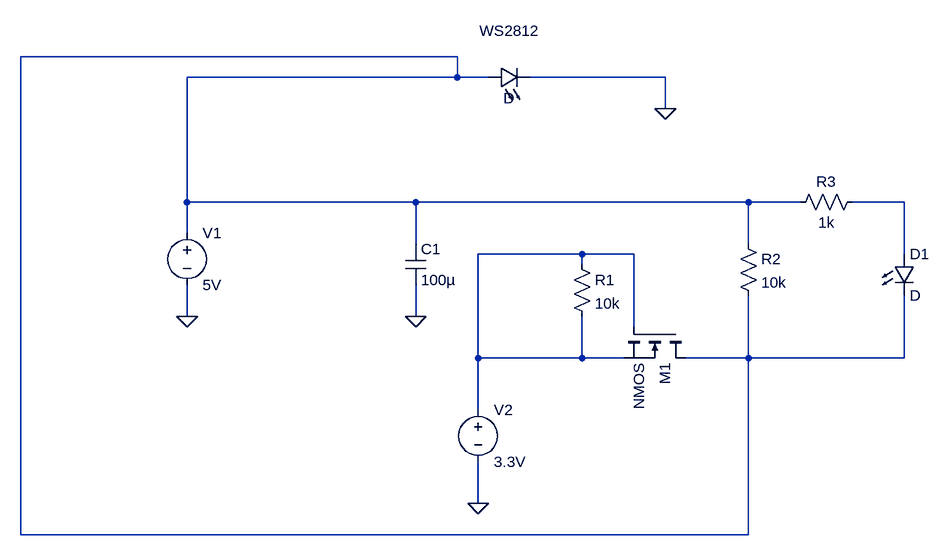
[diagram p0: schematic SmartLight - Schematic1.asc]
SmartLight - Schematic1.asc, the LTspice schematic file:
Version 4
SHEET 1 1212 680
WIRE 464 -128 -208 -128
WIRE 464 -96 464 -128
WIRE 464 -96 48 -96
WIRE 512 -96 464 -96
WIRE 784 -96 576 -96
WIRE 784 -48 784 -96
WIRE 48 96 48 -96
WIRE 400 96 48 96
WIRE 912 96 400 96
WIRE 992 96 912 96
WIRE 1152 96 1072 96
WIRE 48 144 48 96
WIRE 400 160 400 96
WIRE 912 160 912 96
WIRE 656 176 496 176
WIRE 736 176 656 176
WIRE 1152 176 1152 96
WIRE 656 192 656 176
WIRE 48 272 48 224
WIRE 400 272 400 224
WIRE 736 288 736 176
WIRE 496 336 496 176
WIRE 656 336 656 272
WIRE 656 336 496 336
WIRE 720 336 656 336
WIRE 912 336 912 240
WIRE 912 336 816 336
WIRE 1152 336 1152 240
WIRE 1152 336 912 336
WIRE 496 416 496 336
WIRE 496 560 496 496
WIRE -208 608 -208 -128
WIRE 912 608 912 336
WIRE 912 608 -208 608
FLAG 48 272 0
FLAG 496 560 0
FLAG 400 272 0
FLAG 784 -48 0
SYMBOL voltage 48 128 R0
WINDOW 123 0 0 Left 0
WINDOW 39 0 0 Left 0
SYMATTR InstName V1
SYMATTR Value 5V
SYMBOL voltage 496 400 R0
WINDOW 123 0 0 Left 0
WINDOW 39 0 0 Left 0
SYMATTR InstName V2
SYMATTR Value 3.3V
SYMBOL res 640 176 R0
SYMATTR InstName R1
SYMATTR Value 10k
SYMBOL res 896 144 R0
SYMATTR InstName R2
SYMATTR Value 10k
SYMBOL cap 384 160 R0
SYMATTR InstName C1
SYMATTR Value 100µ
SYMBOL nmos 816 288 R90
SYMATTR InstName M1
SYMBOL LED 1136 176 R0
SYMATTR InstName D1
SYMBOL res 1088 80 R90
WINDOW 0 0 56 VBottom 2
WINDOW 3 32 56 VTop 2
SYMATTR InstName R3
SYMATTR Value 1k
SYMBOL LED 512 -80 R270
WINDOW 0 72 32 VTop 2
WINDOW 3 0 32 VBottom 2
SYMATTR InstName WS2812

The netlist it stands for:
* SmartLight - Schematic1.asc
V1 N001 0 5V
V2 N003 0 3.3V
R1 N003 N003 10k
R2 N001 N001 10k
C1 N001 0 100µ
M1 N001 N003 N003 N003 NMOS
D1 N002 N001 D
R3 N002 N001 1k
D§WS2812 N001 0 D
.model D D
.lib standard.dio
.model NMOS NMOS
.model PMOS PMOS
.lib standard.mos
.backanno
.end